# EAGLE design orao-keyboard-routed (EAGLE 9.6.2)
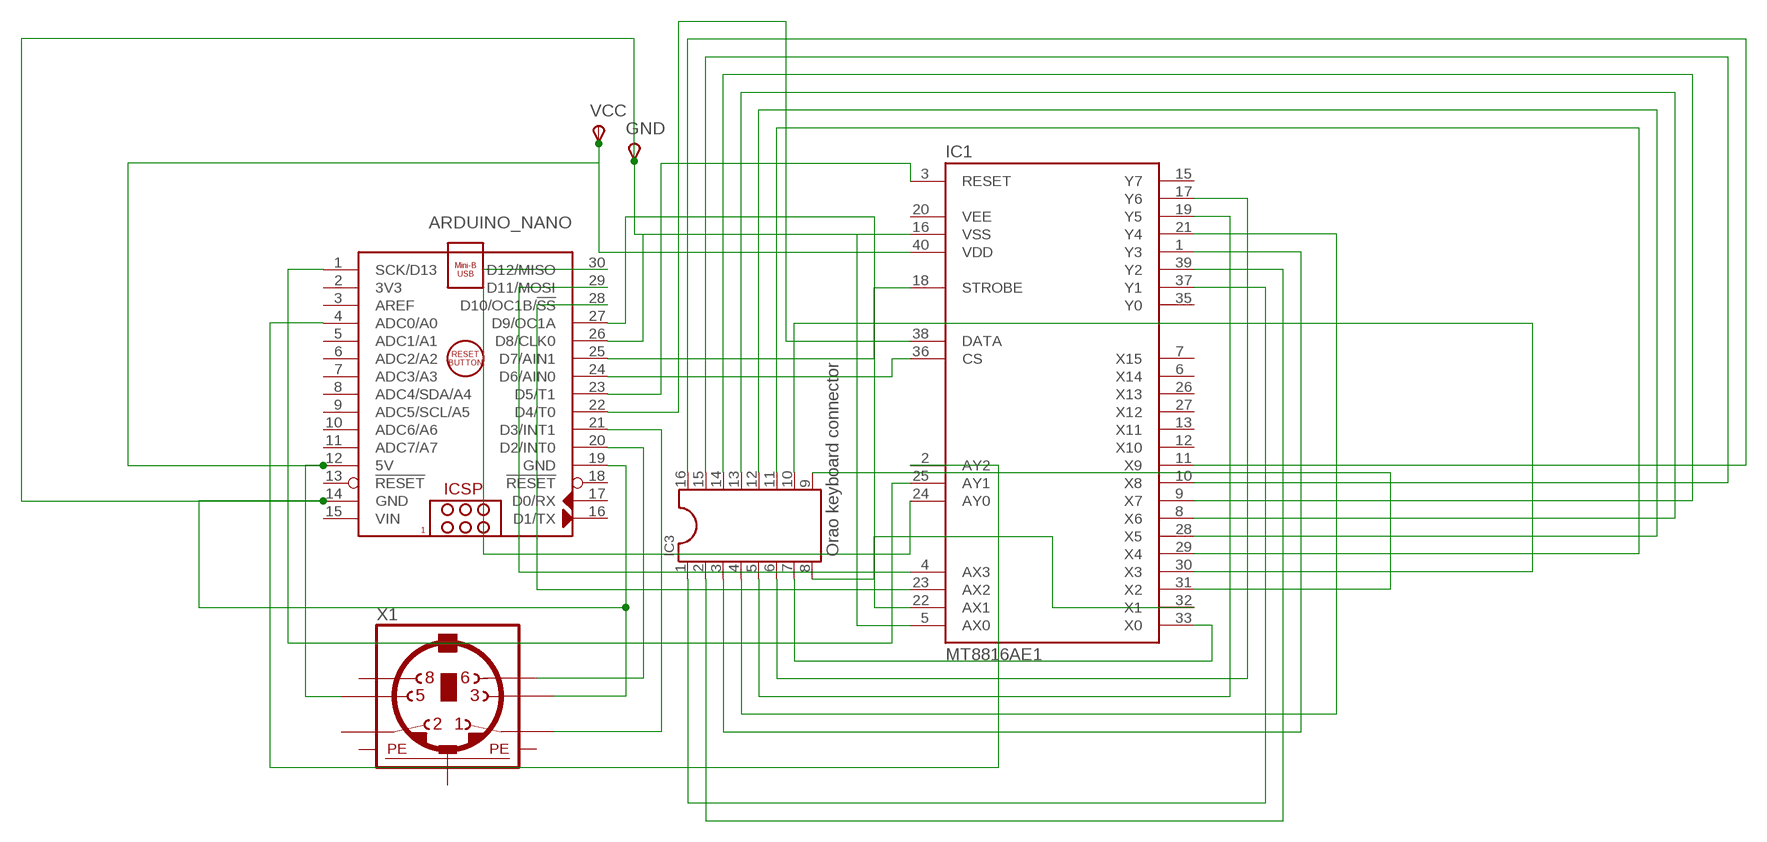
[diagram p0: schematic, sheet 1]

## Parts
ARDUINO_NANO  ARDUINO_NANO  [ARDUINO_NANO]
GND  TPSPAD1-13  [P1-13]
IC1  MT8816AE1  [DIL40]
IC3  Orao keyboard connector  DIL16S  [SOCKED-16]
VCC  TPSPAD1-13  [P1-13]
X1  MINI_DIN_6  [M_DIN6]

## Nets
N$1: ARDUINO_NANO.20(D2/INT0) X1.6
N$2: ARDUINO_NANO.21(D3/INT1) X1.1
N$5: IC1.37(Y1) IC3.1
N$6: IC1.39(Y2) IC3.2
N$7: IC1.1(Y3) IC3.3
N$8: IC1.21(Y4) IC3.4
N$9: IC1.19(Y5) IC3.5
N$10: IC1.17(Y6) IC3.6
N$11: IC1.33(X0) IC3.7
N$12: IC1.32(X1) IC3.8
N$13: IC1.31(X2) IC3.9
N$14: IC1.30(X3) IC3.10
N$15: IC1.29(X4) IC3.11
N$16: IC1.28(X5) IC3.12
N$17: IC1.8(X6) IC3.13
N$18: IC1.9(X7) IC3.14
N$19: IC1.10(X8) IC3.15
N$20: IC1.11(X9) IC3.16
N$21: ARDUINO_NANO.22(D4/T0) IC1.38(DATA)
N$22: ARDUINO_NANO.23(D5/T1) IC1.3(RESET)
N$23: ARDUINO_NANO.24(D6/AIN0) IC1.36(CS)
N$24: ARDUINO_NANO.25(D7/AIN1) IC1.18(STROBE)
N$25: ARDUINO_NANO.26(D8/CLK0) IC1.5(AX0)
N$26: ARDUINO_NANO.27(D9/OC1A) IC1.22(AX1)
N$27: ARDUINO_NANO.28(D10/OC1B/!SS) IC1.23(AX2)
N$28: ARDUINO_NANO.29(D11/MOSI) IC1.4(AX3)
N$29: ARDUINO_NANO.30(D12/MISO) IC1.24(AY0)
N$30: ARDUINO_NANO.1(SCK/D13) IC1.25(AY1)
N$31: ARDUINO_NANO.4(ADC0/A0) IC1.2(AY2)
N$32: ARDUINO_NANO.12(5V) IC1.40(VDD) VCC.TP(PP) X1.5
N$33: ARDUINO_NANO.14(GND) ARDUINO_NANO.19(GND) GND.TP(PP) IC1.16(VSS) X1.3
Unconnected: ARDUINO_NANO.2(3V3) ARDUINO_NANO.3(AREF) ARDUINO_NANO.5(ADC1/A1) ARDUINO_NANO.6(ADC2/A2) ARDUINO_NANO.7(ADC3/A3) ARDUINO_NANO.8(ADC4/SDA/A4) ARDUINO_NANO.9(ADC5/SCL/A5) ARDUINO_NANO.10(ADC6/A6) ARDUINO_NANO.11(ADC7/A7) ARDUINO_NANO.13(!RESET) ARDUINO_NANO.16(D1/TX) ARDUINO_NANO.17(D0/RX) ARDUINO_NANO.18(!RESET) IC1.6(X14) IC1.7(X15) IC1.12(X10) IC1.13(X11) IC1.15(Y7) IC1.26(X13) IC1.27(X12) IC1.35(Y0) X1.2 X1.8

## Power pins joined to a net without a drawn wire
PE1: X1.SH1(PE1)
PE2: X1.SH2(PE2)
PE3: X1.SH3(PE3)
VEE: IC1.20(VEE)
VIN: ARDUINO_NANO.15(VIN)

## Library data of the parts
ARDUINO_NANO = ArduinoNanoV30:ARDUINO_NANO: Arduino Nano V3.0 Module Overview: The Arduino Nano is a small, complete, and breadboard-friendly board based on the ATmega328 (Arduino Nano 3.x) or ATmega168 (Arduino Nano 2.x). It has more or less the same functionality of the Arduino Duemilanove, but in a different package. It lacks only a DC power jack, and works with a Mini-B USB cable instead of a standard one. The Nano was designed and is being produced by Gravitech <http://www.gravitech.us/arna30wiatp.html>. General specifications: Item Value Microcontroller Atmel ATmega168 or ATmega328 Operating Voltage (logic level) 5 V Input Voltage (recommended) 7-12 V Input Voltage (limits) 6-20 V Digital I/O Pins 14 (of which 6 provide PWM output) Analog Input Pins 8 DC Current per I/O Pin 40 mA Flash Memory 16 KB (ATmega168) or 32 KB (ATmega328) of which 2 KB used by bootloader SRAM 1 KB (ATmega168) or 2 KB (ATmega328) EEPROM 512 bytes (ATmega168) or 1 KB (ATmega328) Clock Speed 16 MHz Dimensions (Inches) 0.73" x 1.70" Dimensions (mm) 18mm x 45mm Overall height About 9 mm (not including pins) Weigth 5 g Power: The Arduino Nano can be powered via the Mini-B USB connection, 6-20V unregulated external power supply (pin 30), or 5V regulated external power supply (pin 27). The power source is automatically selected to the highest voltage source. Memory: The ATmega168 has 16 KB of flash memory for storing code (of which 2 KB is used for the bootloader); the ATmega328 has 32 KB, (also with 2 KB used for the bootloader). The ATmega168 has 1 KB of SRAM and 512 bytes of EEPROM (which can be read and written with the EEPROM library); the ATmega328 has 2 KB of SRAM and 1 KB of EEPROM. Input and Output: Each of the 14 digital pins on the Nano can be used as an input or output, using pinMode(), digitalWrite(), and digitalRead() functions. They operate at 5 volts. Each pin can provide or receive a maximum of 40 mA and has an internal pull-up resistor (disconnected by default) of 20-50 kOhms. In addition, some pins have specialized functions. Visit Arduino - ArduinoBoardNano <https://www.arduino.cc/en/Main/ArduinoBoardNano>
GND VCC = testpad:TPS: TEST PIN
IC1 = MT8816:MT8816: 8x16 Analog Switch Array
IC3 = ic-package:DIL16: Dual In Line
X1 = mini_din:MINI_DIN_6

## Board
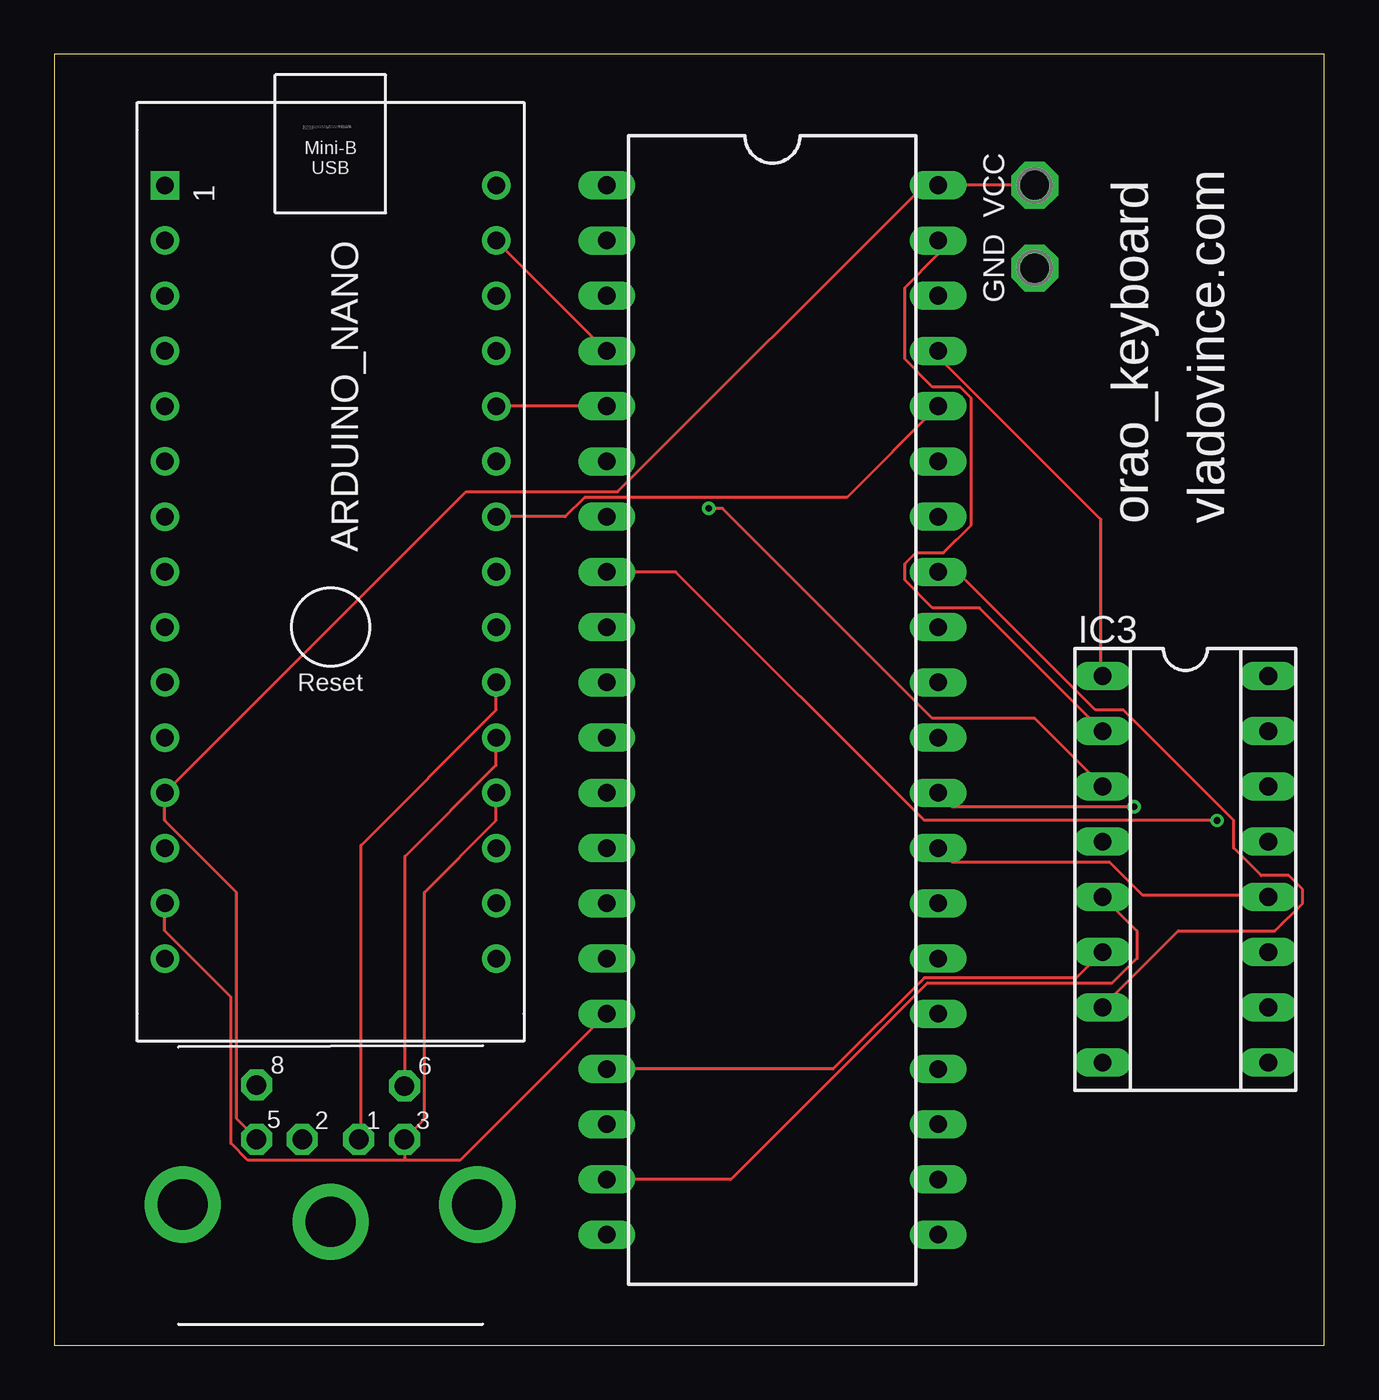
[diagram p1: board, top side]
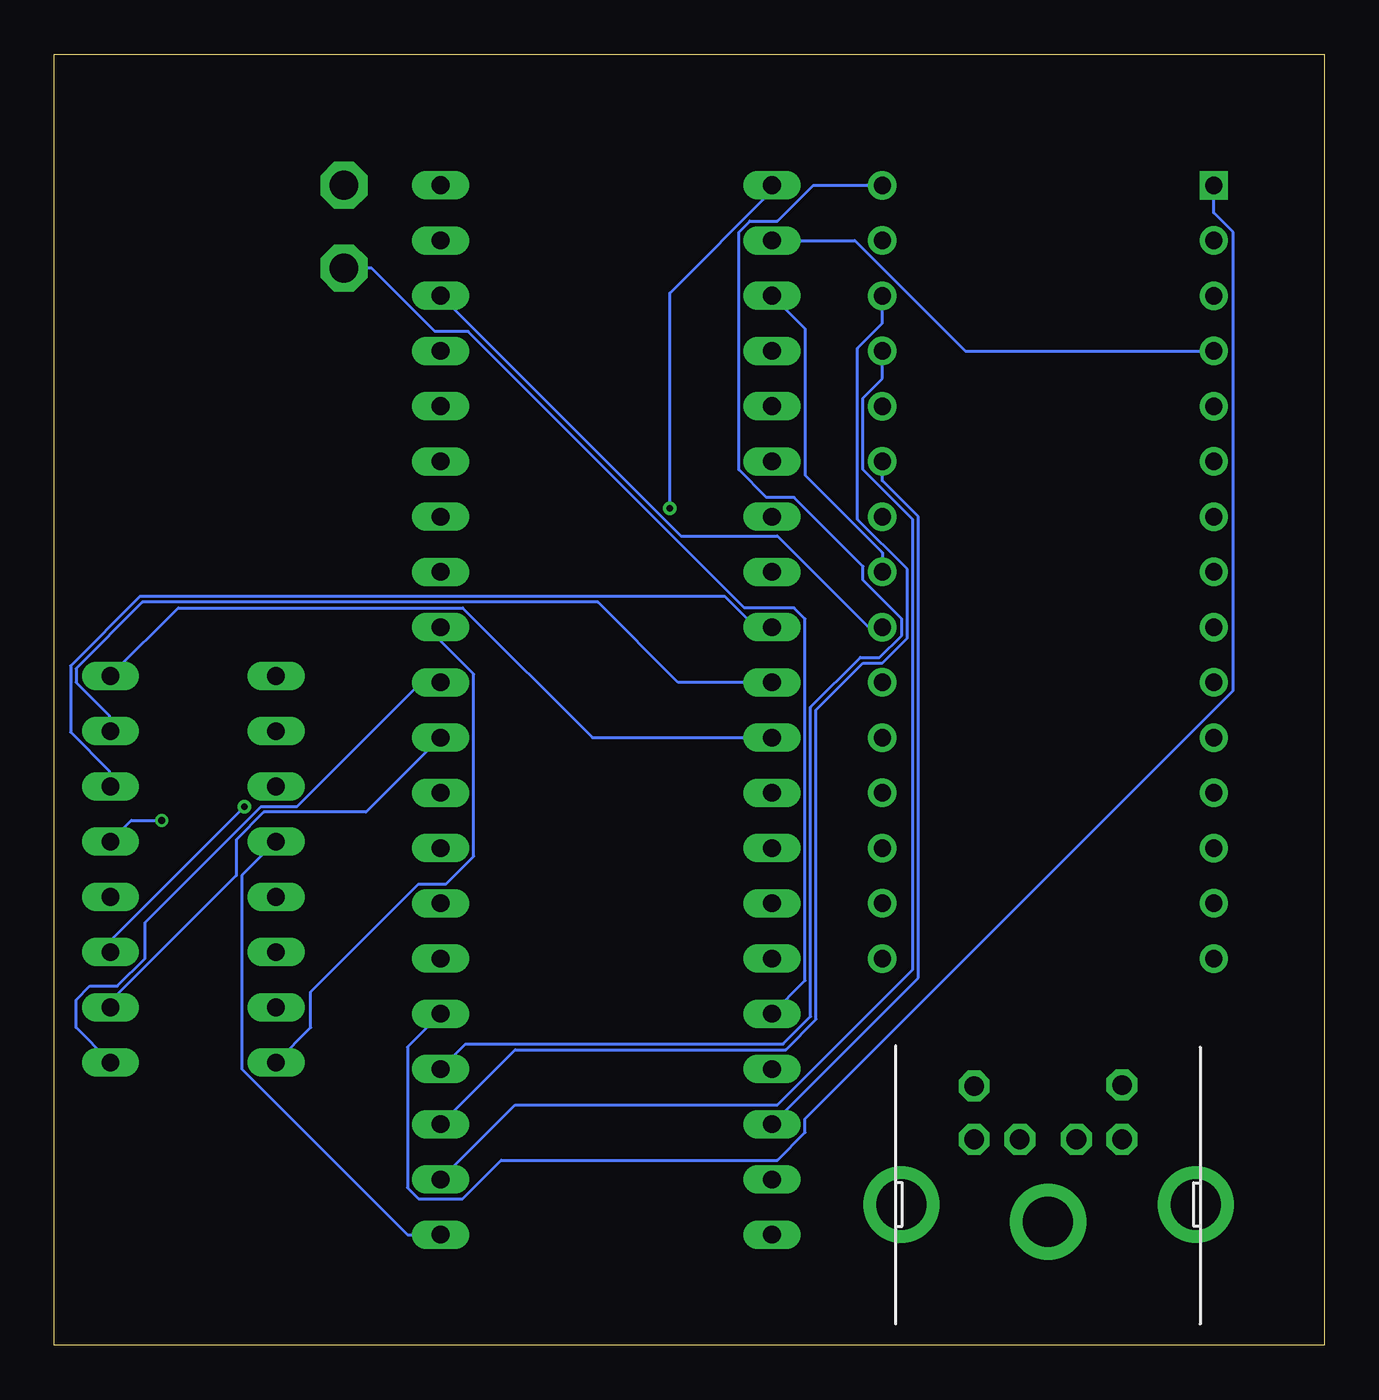
[diagram p2: board, bottom side, seen from below]

Size 58.4 x 59.36 mm. Coordinates in mm from the lower left corner, seen from the top.
Outline: 0,0 58.4,0 58.4,59.36 0,59.36 0,0
Copper layers (1*16): Top 0.035mm / dielectric 1.5mm / Bottom 0.035mm
Design rules "dirt_cheap_dirty_boards.v1": minimum track width 5mil, minimum drill 12mil, track to track 5mil, track to pad 5mil, pad to pad 5mil, via to via 5mil, smd to smd 0mil, copper to edge 10mil, drill to drill 10mil, minimum pad ring 10mil, minimum via ring 6mil, stop-mask expansion 2mil, vias tented up to drill 25mil, thermal gap 10mil

### Footprints (pad centres in the part's own frame; a part is rotated, then mirrored left to right if it is on the bottom)
ARDUINO_NANO = drill 0.8 square: 1 -20.32,-7.62 | drill 0.8: 2 -17.78,-7.62; 3 -15.24,-7.62; 4 -12.7,-7.62; 5 -10.16,-7.62; 6 -7.62,-7.62; 7 -5.08,-7.62; 8 -2.54,-7.62; 9 0,-7.62; 10 2.54,-7.62; 11 5.08,-7.62; 12 7.62,-7.62; 13 10.16,-7.62; 14 12.7,-7.62; 15 15.24,-7.62; 16 15.24,7.62; 17 12.7,7.62; 18 10.16,7.62; 19 7.62,7.62; 20 5.08,7.62; 21 2.54,7.62; 22 0,7.62; 23 -2.54,7.62; 24 -5.08,7.62; 25 -7.62,7.62; 26 -10.16,7.62; 27 -12.7,7.62; 28 -15.24,7.62; 29 -17.78,7.62; 30 -20.32,7.62
P1-13 = drill 1.321 pad 2.159 octagon: TP 0,0
DIL40 = drill 0.813 long: 1 -24.13,-7.62; 2 -21.59,-7.62; 3 -19.05,-7.62; 4 -16.51,-7.62; 5 -13.97,-7.62; 6 -11.43,-7.62; 7 -8.89,-7.62; 8 -6.35,-7.62; 9 -3.81,-7.62; 10 -1.27,-7.62; 11 1.27,-7.62; 12 3.81,-7.62; 13 6.35,-7.62; 14 8.89,-7.62; 15 11.43,-7.62; 16 13.97,-7.62; 17 16.51,-7.62; 18 19.05,-7.62; 19 21.59,-7.62; 20 24.13,-7.62; 21 24.13,7.62; 22 21.59,7.62; 23 19.05,7.62; 24 16.51,7.62; 25 13.97,7.62; 26 11.43,7.62; 27 8.89,7.62; 28 6.35,7.62; 29 3.81,7.62; 30 1.27,7.62; 31 -1.27,7.62; 32 -3.81,7.62; 33 -6.35,7.62; 34 -8.89,7.62; 35 -11.43,7.62; 36 -13.97,7.62; 37 -16.51,7.62; 38 -19.05,7.62; 39 -21.59,7.62; 40 -24.13,7.62
SOCKED-16 = drill 0.813 long: 1 -8.89,-3.81; 2 -6.35,-3.81; 3 -3.81,-3.81; 4 -1.27,-3.81; 5 1.27,-3.81; 6 3.81,-3.81; 7 6.35,-3.81; 8 8.89,-3.81; 9 8.89,3.81; 10 6.35,3.81; 11 3.81,3.81; 12 1.27,3.81; 13 -1.27,3.81; 14 -3.81,3.81; 15 -6.35,3.81; 16 -8.89,3.81
M_DIN6 = drill 0.9 pad 1.422 octagon: 1 -1.3,-3.75; 2 1.3,-3.75; 3 -3.4,-3.75; 5 3.4,-3.75; 6 -3.4,-6.2; 8 3.4,-6.25 | drill 2.3 pad 3.5: SH1 6.8,-0.75; SH2 0,0.05; SH3 -6.75,-0.75

### Placement (x,y rotation side)
ARDUINO_NANO  12.7,33.02 270 top
GND  45.08,49.53 90 top
IC1  33.02,29.21 270 top
IC3  52.02,21.88 270 top
VCC  45.08,53.34 90 top
X1  12.7,5.71 180 top

### Tracks (layer width: path | path; a pad name or v marks a point on that pad's centre or on a via)
N$1
  Top 0.127: ARDUINO_NANO.20 20.32,26.67 16.13,22.48 16.13,11.94 X1.6
N$2
  Top 0.127: ARDUINO_NANO.21 20.32,29.21 14.1,22.99 14.1,9.53 X1.1
N$5
  Top 0.127: IC1.37 40.64,45.47 48.13,37.97 48.13,30.86 IC3.1
N$6
  Top 0.127: IC1.39 40.64,50.16 39.12,48.64 39.12,45.34 40.39,44.07 41.66,44.07 42.16,43.56 42.16,37.72 40.89,36.45 39.62,36.45 39.12,35.94 39.12,35.18 40.39,33.91 42.54,33.91 48.13,28.32 IC3.2
N$7  (via drill 0.3)
  Top 0.127: v30.1,38.48 30.73,38.48 40.39,28.83 45.08,28.83 48.13,25.78 IC3.3
  Bottom 0.127: IC1.1 25.4,53.09 30.1,48.39 v30.1,38.48
N$8
  Bottom 0.127: IC1.21 42.16,5.08 49.78,12.7 49.78,21.59 48.26,23.11 IC3.4
N$9
  Top 0.127: IC1.19 31.12,7.62 40.13,16.64 48.64,16.64 49.78,17.78 49.78,19.05 48.26,20.57 IC3.5
N$10
  Top 0.127: IC1.17 35.81,12.7 40,16.89 46.99,16.89 48.13,18.03 IC3.6
N$11
  Top 0.127: IC1.33 41.53,35.56 47.88,29.21 49.15,29.21 54.23,24.13 54.23,22.86 55.5,21.59 56.77,21.59 57.4,20.95 57.4,20.32 56.13,19.05 51.69,19.05 48.26,15.62 IC3.7
N$12
  Bottom 0.127: IC1.32 40.64,32.38 39.12,30.86 39.12,22.48 40.39,21.21 41.66,21.21 46.61,16.26 46.61,14.61 48.13,13.08 IC3.8
N$13
  Bottom 0.127: IC1.31 41.53,30.48 47.24,24.77 48.89,24.77 54.23,19.43 54.23,17.78 55.5,16.51 56.77,16.51 57.4,15.88 57.4,14.61 55.88,13.08 IC3.9
N$14
  Bottom 0.127: IC1.30 44.07,24.51 48.77,24.51 50.04,23.24 50.04,21.59 55.75,15.88 55.75,15.62 IC3.10
N$15  (via drill 0.3)
  Top 0.127: v49.66,24.77 41.27,24.77 IC1.29
  Bottom 0.127: v49.66,24.77 55.75,18.67 55.75,18.16 IC3.11
N$16
  Top 0.127: IC1.28 41.27,22.22 48.51,22.22 50.04,20.7 55.75,20.7 IC3.12
N$17  (via drill 0.3)
  Top 0.127: IC1.8 28.57,35.56 40,24.13 v53.47,24.13
  Bottom 0.127: v53.47,24.13 54.86,24.13 55.75,23.24 IC3.13
N$18
  Bottom 0.127: IC1.9 26.16,33.02 27.56,34.42 54.48,34.42 57.66,31.24 57.66,28.19 55.88,26.42 55.88,25.78 IC3.14
N$19
  Bottom 0.127: IC1.10 29.72,30.48 33.4,34.16 54.36,34.16 57.4,31.11 57.4,30.48 55.88,28.96 55.88,28.32 IC3.15
N$20
  Bottom 0.127: IC1.11 33.66,27.94 39.62,33.91 52.7,33.91 55.75,30.86 IC3.16
N$21
  Bottom 0.127: ARDUINO_NANO.22 20.96,33.02 25.15,37.21 29.59,37.21 IC1.38
N$22
  Bottom 0.127: ARDUINO_NANO.23 20.32,36.45 23.88,40.01 23.88,46.74 IC1.3
N$23
  Top 0.127: ARDUINO_NANO.24 23.5,38.1 24.38,38.99 36.45,38.99 IC1.36
N$24
  Bottom 0.127: ARDUINO_NANO.25 20.32,39.75 18.67,38.1 18.67,16.89 IC1.18
N$25
  Top 0.127: IC1.5 ARDUINO_NANO.26
N$26
  Bottom 0.127: ARDUINO_NANO.27 20.32,44.45 21.21,43.56 21.21,40.26 18.92,37.97 18.92,17.27 25.15,11.05 37.21,11.05 IC1.22
N$27
  Bottom 0.127: ARDUINO_NANO.28 20.32,46.99 21.46,45.85 21.46,37.97 19.18,35.69 19.18,32.51 20.32,31.37 21.21,31.37 23.37,29.21 23.37,14.99 24.77,13.59 37.21,13.59 IC1.23
N$28
  Top 0.127: IC1.4 ARDUINO_NANO.29
N$29
  Bottom 0.127: ARDUINO_NANO.30 23.5,53.34 25.15,51.69 26.42,51.69 26.92,51.18 26.92,40.26 25.65,38.99 24.38,38.99 21.21,35.81 21.21,35.18 19.43,33.4 19.43,32.64 20.45,31.62 21.34,31.62 23.62,29.34 23.62,15.11 24.89,13.84 39.5,13.84 IC1.24
N$30
  Bottom 0.127: ARDUINO_NANO.1 5.08,52.07 4.19,51.18 4.19,30.1 23.88,10.41 23.88,9.78 25.15,8.51 37.85,8.51 39.62,6.73 41.66,6.73 42.16,7.24 42.16,13.72 IC1.25
N$31
  Bottom 0.127: ARDUINO_NANO.4 16.51,45.72 21.59,50.8 IC1.2
N$32
  Top 0.127: VCC.TP IC1.40 40,53.34 25.91,39.24 18.92,39.24 ARDUINO_NANO.12 5.08,24.13 8.38,20.83 8.38,10.41 9.27,9.53 X1.5
N$33
  Top 0.127: ARDUINO_NANO.14 5.08,19.05 8.13,16 8.13,9.27 8.89,8.51 16.13,8.51 | 16.13,8.51 18.67,8.51 IC1.16 | ARDUINO_NANO.19 20.32,24.13 17.02,20.83 17.02,10.41 16.13,9.53 X1.3 16.13,9.4 16.13,8.51
  Bottom 0.127: GND.TP 43.81,49.53 40.89,46.61 39.37,46.61 26.67,33.91 24.38,33.91 23.88,33.4 23.88,16.76 IC1.16

### Text on the board
tNames: orao_keyboard | vladovince.com